# EasyEDA Pro project stm32-motordrive.epro, schematic Schematic3_copy1
Create Date: 2024-04-02; Page Name: P1; Project Name: stm32-motordrive; Schematic Name: Schematic3; Update Date: 2024-04-08; Company: 嘉立创EDA; Page Size: A4; Version: V1.0
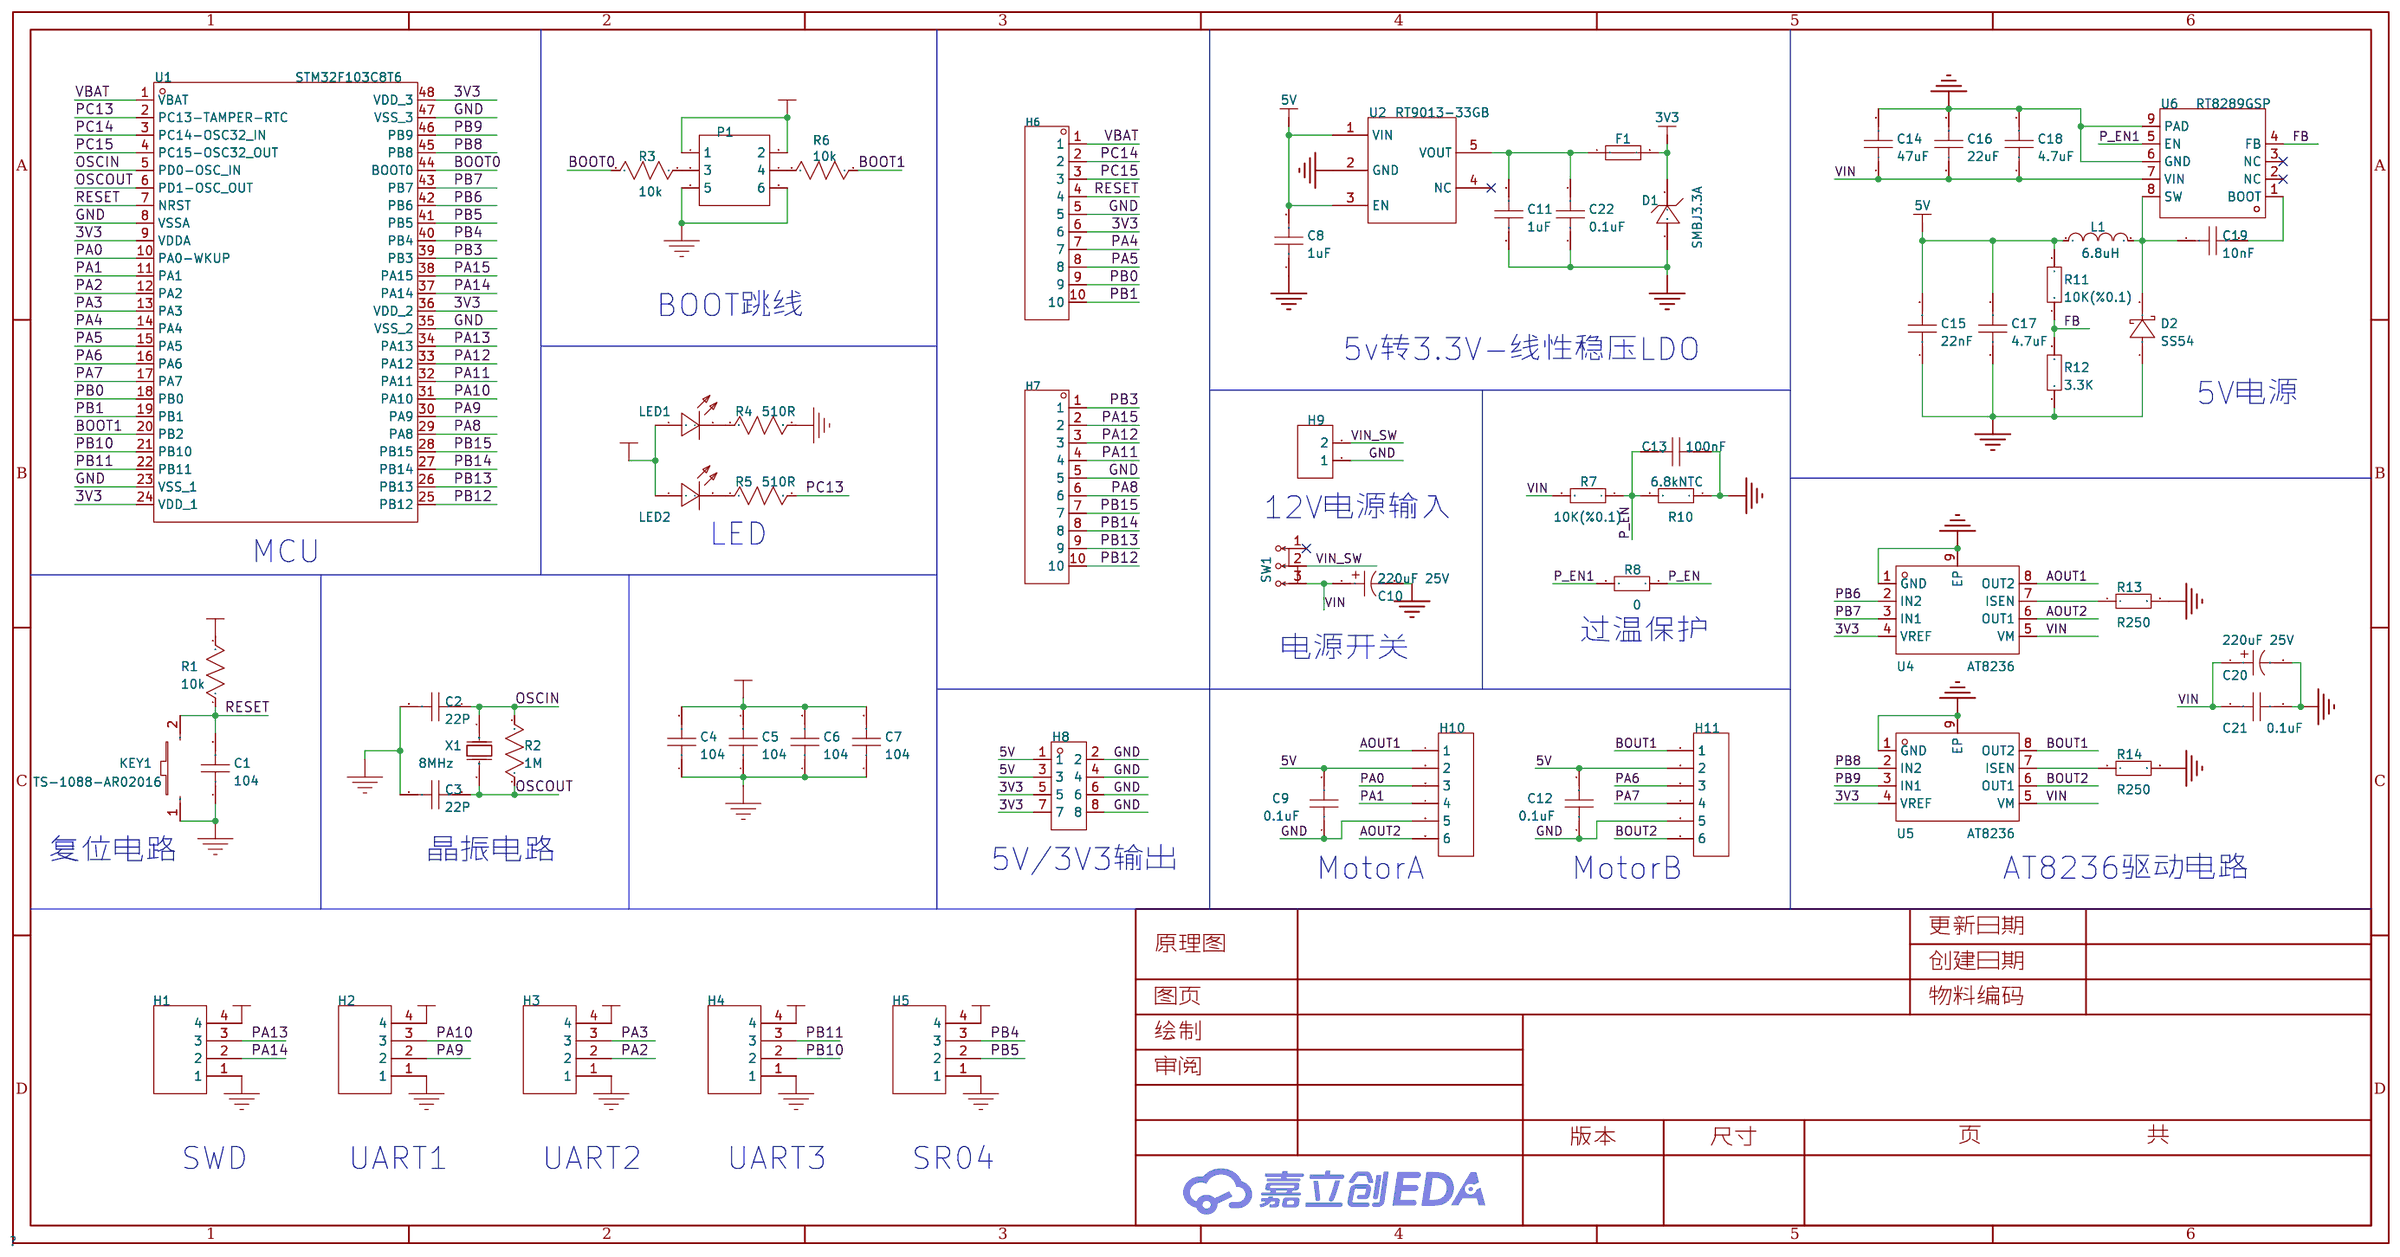
[diagram p1: schematic sheet]

## Parts
C1  104  [C0603]
C2  22P  [C0603]
C3  22P  [C0603]
C4  104  [C0603]
C5  104  [C0603]
C6  104  [C0603]
C7  104  [C0603]
C8  1uF  [C0603]
C9  0.1uF  [C0603]
C10  220uF 25V  [CAP-SMD_BD6.3-L6.6-W6.6-LS7.2-FD]
C11  1uF  [C0603]
C12  0.1uF  [C0603]
C13  100nF  [C0603]
C14  47uF  [C0603]
C15  22nF  [C0603]
C16  22uF  [C0603]
C17  4.7uF  [C0603]
C18  4.7uF  [C0603]
C19  10nF  [C0603]
C20  220uF 25V  [CAP-SMD_BD6.3-L6.6-W6.6-LS7.2-FD]
C21  0.1uF  [C0603]
C22  0.1uF  [C0603]
D1  SMBJ3.3A  [SMB_L4.6-W3.6-LS5.3-RD]
D2  SS54  [SMA_L4.3-W2.6-LS5.0-FD]
F1  BSMD0603-050-6V  [F0603]
H1  PZ254V-11-04P  [HDR-TH_4P-P2.54-V-M]
H2  PZ254V-11-04P  [HDR-TH_4P-P2.54-V-M]
H3  PZ254V-11-04P  [HDR-TH_4P-P2.54-V-M]
H4  PZ254V-11-04P  [HDR-TH_4P-P2.54-V-M]
H5  PZ254V-11-04P  [HDR-TH_4P-P2.54-V-M]
H6  2.54-1*10P针  [HDR-TH_10P-P2.54-V-M-1]
H7  2.54-1*10P针  [HDR-TH_10P-P2.54-V-M-1]
H8  PZ2.54-2*4  [HDR-TH_8P-P2.54-V-M-R2-C4-S2.54]
H9  XY301V-A-5.0-2P  [CONN-TH_XY301V-A-5.0-2P]
H10  -  [XH2.54-LI-6P弯针]
H11  -  [XH2.54-LI-6P弯针]
KEY1  TS-1088-AR02016  [SW-SMD_L3.9-W3.0-P4.45]
L1  6.8uH  [IND-SMD_L7.0-W6.6]
LED1  NCD0805R1  [LED0805-R-RD]
LED2  NCD0805R1  [LED0805-R-RD]
P1  2.54-2*3P针  [HDR-TH_6P-P2.54-V-M-R2-C3-S2.54-1]
R1  10k  [R0603]
R2  1M  [R0603]
R3  10k  [R0603]
R4  510R  [R0603]
R5  510R  [R0603]
R6  10k  [R0603]
R7  10K(%0.1)  [R0603]
R8  0  [R0603]
R10  6.8kNTC  [R0603]
R11  10K(%0.1)  [R0603]
R12  3.3K  [R0603]
R13  R250  [R0603]
R14  R250  [R0603]
SW1  -  [SW-TH_SHOU-HAN_SS12D10G4]
U1  STM32F103C8T6  [LQFP-48_L7.0-W7.0-P0.50-LS9.0-BL]
U2  RT9013-33GB  [SOT-23-5_L3.0-W1.7-P0.95-LS2.8-BL]
U4  AT8236  [ESOP-8_L4.9-W3.9-P1.27-LS6.0-BL-EP]
U5  AT8236  [ESOP-8_L4.9-W3.9-P1.27-LS6.0-BL-EP]
U6  RT8289GSP  [SOIC-8_L5.0-W4.0-P1.27-LS6.0-BL-EP2.0]
X1  8MHz  [CRYSTAL-SMD_L5.0-W3.2]

## Library data of the parts
C1 C4-C7 = 104
C2 C3 = 22P
C8 C9 C11-C19 C21 C22 = CAP_0603: Supplier Footprint: 0603
C10 C20 = RST220UF25V019: 容值:220uF;精度:±20%;额定电压:25V;纹波电流:165mA@120Hz;等效串联电阻:-;; LCSC Part Name: 220uF ±20% 25V; Supplier Part: C4747974; Manufacturer: KNSCHA(科尼盛); Supplier Footprint: SMD,D6.3xL7.7mm; JLCPCB Part Class: Extended Part; Datasheet: https://atta.szlcsc.com/upload/public/pdf/source/20220722/2E7F51AC9BE193B364DA1207D7353D66.pdf; Supplier: LCSC; Tolerance: ±20%; Rated Voltage: 25V; Ripple Current: 165mA@120Hz; φD: 6.3mm; L: 7.7mm; Lifetime @ Temp: 2000hrs@105℃; Operating Temperature: -40℃~+105℃
D1 = SMBJ3.3A_C362089: 反向截止电压(Vrwm):3.3V;最大钳位电压:7.3V;峰值脉冲功率(Ppp)@10/1000us:600W;击穿电压:4.1V;; LCSC Part Name: 单向TVS 3.3V截止 600W峰值脉冲功率; Supplier Part: C362089; Manufacturer: JKSEMI(金开盛); Supplier Footprint: SMB(DO-214AA); JLCPCB Part Class: 扩展库; Datasheet: https://atta.szlcsc.com/upload/public/pdf/source/20200731/C362089_3B984BF84356FE4A5051ADB3F5B1E766.pdf; Supplier: LCSC; Reverse Stand-Off Voltage (Vrwm): 3.3V; Maximum Clamping Voltage: 7.3V; Peak Pulse Power Dissipation (Ppp)@10/1000us: 600W; Breakdown Voltage: 4.1V; Type: TVS
D2 = SS54_C7420369: 二极管配置:独立式;正向压降(Vf):550mV@5.0A;直流反向耐压(Vr):40V;平均整流电流(Io):5A;; LCSC Part Name: 电压:40V 电流:5A; Supplier Part: C7420369; Manufacturer: 宏迦橙; Supplier Footprint: SMA(DO-214AC); JLCPCB Part Class: 扩展库; Datasheet: https://atta.szlcsc.com/upload/public/pdf/source/20230828/254C3882F8647358AD9F60DD73611B5E.pdf; Supplier: LCSC; Diode Configuration: 独立式; Forward Voltage (Vf@If): 550mV@5.0A; Reverse Voltage (Vr): 40V; Average Rectified Current (Io): 5A; Reverse Leakage Current (Ir): 50uA@40V; Peak forward surge current: 120A
F1 = BSMD0603-050-6V: 最大电压:6V;最大电流:40A;保持电流:500mA;跳闸电流:1A;; LCSC Part Name: 6V 500mA 0603自恢复; Supplier Part: C883095; Manufacturer: BHFUSE(佰宏); Supplier Footprint: 0603; JLCPCB Part Class: Extended Part; Datasheet: https://atta.szlcsc.com/upload/public/pdf/source/20230512/E478DE3555A0061DA0124A9F45802B86.pdf; Supplier: LCSC; Operating Voltage (Max): 6V; Current Rating (Max): 40A; Hold Current: 500mA; Trip Current: 1A; Power Dissipation: 500mW; Resistance - Initial (Ri) (Min): 100mΩ; Resistance - Post Trip (R1) (Max): 800mΩ; Maximum Time to Trip: 100ms; Operating Temperature: -40℃~+85℃
H1-H5 = PZ254V-11-04P: 插针结构:1x4P;间距:2.54mm;行距:-;圆针/方针:方针;安装类型:直插;排数:单排;总PIN位数:4P;额定电流:3A;额定电压:250V;配合针长度:6mm;塑高:2.5mm;端接针长度:3mm;触头材质:-;工作温度范围:-40℃~+105℃;颜色:黑色;; LCSC Part Name: 间距:2.54mm 1x4P 直插 方针; Supplier Part: C2691448; Manufacturer: XFCN(兴飞); Supplier Footprint: 插件,P=2.54mm; JLCPCB Part Class: Extended Part; Datasheet: https://atta.szlcsc.com/upload/public/pdf/source/20200309/C492403_F9F19131791D08044AD4F84F8E751A34.pdf; Supplier: LCSC; Pin Structure: 1x4P; Pitch: 2.54mm; Circluar Pins/Square Pins: 方针; Mounting Type: 直插; Number of Rows: 单排; Number of Pins: 4P; Current Rating (Max): 3A; Voltage Rating (Max): 250V; Length of Mating Pin: 6mm; Insulation Height: 2.5mm; Length of End Connection Pin: 3mm; Operating Temperature Range: -40℃~+105℃; Color: 黑色; Origin Footprint 1: 220S-1*4P H=8.5MM Ytype Gold-plated; Origin Footprint 2: DIP-1X4P2.54
H6 H7 = 2.54-1*10P针: 插针结构:1x10P;间距:2.54mm;行距:-;圆针/方针:方针;安装类型:直插;排数:单排;总PIN位数:10P;额定电流:3A;额定电压:-;配合针长度:-;塑高:-;端接针长度:-;触头材质:-;触头镀层:-;工作温度范围:-40℃~+105℃;颜色:黑色;; LCSC Part Name: 间距:2.54mm 1x10P 直插 方针; Supplier Part: C57369; Manufacturer: BOOMELE(博穆精密); Supplier Footprint: 插件,P=2.54mm; JLCPCB Part Class: 扩展库; Datasheet: https://atta.szlcsc.com/upload/public/pdf/source/20151109/1457707572883.pdf; Supplier: LCSC; Pin Structure: 1x10P; Pitch: 2.54mm; Circluar Pins/Square Pins: 方针; Mounting Type: 直插; Number of Rows: 单排; Number of Pins: 10P; Current Rating (Max): 3A; Operating Temperature Range: -40℃~+105℃; Color: 黑色
H8 = PZ2.54-2*4: 插针结构:2x4P;间距:2.54mm;排数:双排;总PIN位数:8P;; Supplier Part: C5156676; Manufacturer: ZHOURI(洲日); Supplier Footprint: 插件,P=2.54mm; JLCPCB Part Class: 扩展库; Datasheet: https://atta.szlcsc.com/upload/public/pdf/source/20220923/0E7A4A94740FFD503E2D73F36F92C1EA.pdf; Supplier: LCSC; Pin Structure: 2x4P; Pitch: 2.54mm; Number of Rows: 双排; Number of Pins: 8P
H9 = XY301V-A-5.0-2P: 结构:1x2P;间距:5mm;颜色:蓝色;安装方式:直插;额定电流:15A;额定电压:300V;排数:1;线规 - AWG:14~22;线规 - 平方毫米:1.5;每排PIN数:2;工作温度范围:-;; LCSC Part Name: 5mm 1x2P 排数:1 每排P数:2 直插; Supplier Part: C557651; Manufacturer: XINLAIYA(新莱亚); Supplier Footprint: 插件,P=5mm; JLCPCB Part Class: Extended Part; Datasheet: https://atta.szlcsc.com/upload/public/pdf/source/20200527/C557652_0563DB88D69D1781C63AEA43A3E9DCA1.pdf; Supplier: LCSC; Structure: 1x2P; Pitch: 5mm; Color: 蓝色; Mounting Style: 直插; Current Rating (Max): 15A; Voltage Rating (Max): 300V; Number of Pins: 2P; Number of Rows: 1; Wire Gauge - AWG: 14~22; Wire Gauge - mm2: 1.5; Number of PINs Per Row: 2
H10 H11 = XH2.54-LI-6P弯针
KEY1 = TS-1088-AR02016: 电路结构:单刀单掷;按钮形状:圆形按钮;作用力:160gf;安装方式:立贴;开关长度:4mm;开关宽度:3mm;开关高度:2mm;带支架:不带;触点电流:50mA;额定电压(DC):12V;绝缘电阻:100MΩ;机械寿命:10万次;; LCSC Part Name: 4*3*2mm 立贴 轻触开关; Supplier Part: C720477; Manufacturer: XUNPU(讯普); Supplier Footprint: SMD; JLCPCB Part Class: Extended Part; Datasheet: https://atta.szlcsc.com/upload/public/pdf/source/20200810/C720475_60D09DD6C54279ADDB2DC25100F1CC11.pdf; Supplier: LCSC; Circuit: 单刀单掷; Actuator Style: 圆形按钮; Operating Force: 160gf; Mounting Style: 立贴; Switch Length: 4mm; Switch Width: 3mm; Switch Height: 2mm; Strike Gundam: 不带; Contact Current: 50mA; Voltage Rating (DC): 12V; Insulation Resistance: 100MΩ; Actuator/Cap Color: 黑色; Pin Style: SMD接片; Mechanical Life: 10万次; Operating Temperature: -30℃~+80℃; Origin Footprint 1: Switch3x4x2; Origin Footprint 2: KEY-3.0*4.0
L1 = FXL0630-6R8-M: 电感值:6.8uH;精度:±20%;额定电流:5A;饱和电流(Isat):6A;类型:一体成型电感;; LCSC Part Name: 6.8uH ±20% 6A; Supplier Part: C167221; Manufacturer: cjiang(长江微电); Supplier Footprint: SMD,6.6x7mm; JLCPCB Part Class: Extended Part; Datasheet: https://atta.szlcsc.com/upload/public/pdf/source/20230516/3A080F5AF8C87BB81C3BA86E5F60E51A.pdf; Supplier: LCSC; Tolerance: ±20%; Rated Current: 5A; Saturation Current (Isat): 6A; DC Resistance (DCR): 48mΩ; Type: 一体成型电感
LED1 LED2 = NCD0805R1: 灯头类型:-;发光颜色:红色;正向电压(VF):1.6V~2.6V;功率:65mW;正向电流:20mA;主波长:615nm~630nm;二极管配置:独立二极管;透镜颜色:无色透明透镜;色温:-;发光强度:67mcd~195mcd;发光角度:130°;载带方式:-;工作温度:-30℃~+85℃;; Supplier Part: C84256; Manufacturer: 国星光电; Supplier Footprint: 0805; JLCPCB Part Class: Basic Part; Datasheet: https://atta.szlcsc.com/upload/public/pdf/source/20200820/C84256_F0A75A43B3EAD75808600A0514C76B99.pdf; Supplier: LCSC; Emitted Color: 红色; Forward Voltage (VF): 1.6V~2.6V; Power Dissipation: 65mW; Forward Current: 20mA; Dominant Wavelength: 615nm~630nm; Diode Configuration: 独立二极管; Lens Color: 无色透明透镜; Luminous Intensity: 67mcd~195mcd; Viewing Angle: 130°; Operating Temperature: -30℃~+85℃; Origin Footprint 1: 204-10SURD/S530-A3; Origin Footprint 2: LED0805-RD
P1 = 2.54-2*3P针: 插针结构:-;间距:2.54mm;行距:-;圆针/方针:-;安装类型:直插;排数:双排;总PIN位数:6P;额定电流:-;额定电压:-;配合针长度:-;塑高:-;触头材质:-;触头镀层:-;颜色:黑色;; LCSC Part Name: 间距:2.54mm 直插; Supplier Part: C65114; Manufacturer: BOOMELE(博穆精密); Supplier Footprint: 插件,P=2.54mm; JLCPCB Part Class: Extended Part; Supplier: LCSC; Pitch: 2.54mm; Mounting Type: 直插; Number of Rows: 双排; Number of Pins: 6P; Color: 黑色; Origin Footprint 1: HDR-IDC-2.54-2X3P; image: //image.lceda.cn/szlcsc/C11214.jpg; Origin Footprint 2: HEADER_PRG_2X3
R1 R3 R6 = 10k
R2 = 1M
R4 R5 = 510R
R7 R8 R10-R14 = Res_0603: Supplier Footprint: 0603
SW1 = 3脚两档开关(SS12D10G4型号）
U1 = STM32F103C8T6: CPU内核:CM3;程序存储容量:64KB;RAM总容量:20KB;GPIO端口数量:37;工作电压范围:2V~3.6V;CPU最大主频:72MHz;程序存储器类型:FLASH;; LCSC Part Name: STM32F103C8T6 MSL=3; Supplier Part: C8734; Manufacturer: ST(意法半导体); Supplier Footprint: LQFP-48(7x7); JLCPCB Part Class: Extended Part; Datasheet: https://atta.szlcsc.com/upload/public/pdf/source/20220812/8363ACEC51AD55ECEB84799464F7CB85.pdf; Supplier: LCSC; CPU Core: CM3; Program Storage Size: 64KB; RAM Size: 20KB; GPIO Ports Number: 37; Operating Voltage Range: 2V~3.6V; CPU Maximum Speed: 72MHz; Program Memory Type: FLASH; Operating Temperature Range: -40℃~+85℃; ADC (Bit): 12bit; Universal Serial Bus: 有; Peripheral/Function: 看门狗；DMA；看门狗；片载温度传感器; Watchdog: 有; Infrared Data Association: 有; Low-Voltage Detect: 有; Direct Memory Access: 有; Internal Oscillator: 有; image: //image.lceda.cn/szlcsc/C8734.jpg
U2 = RT9013-33GB: 输出类型:固定;最大输入电压:5.5V;输出电压:3.3V;最大输出电流:500mA;电源纹波抑制比(PSRR):50dB@(10kHz);输出极性:正极;; LCSC Part Name: 输入5.5V 输出3.3V 500mA; Supplier Part: C47773; Manufacturer: RICHTEK(立锜); Supplier Footprint: SOT-23-5; JLCPCB Part Class: 扩展库; Datasheet: https://atta.szlcsc.com/upload/public/pdf/source/20150504/1457707282459.pdf; Supplier: LCSC; Output Type: 固定; Maximum Input Voltage: 5.5V; Output Voltage: 3.3V; MAX Output Current: 500mA; Power Supply Rejection Ratio (PSRR): 50dB@(10kHz); Dropout Voltage: 400mV@(500mA); standby current: 50uA; Operating Temperature: -40℃~+85℃; Output Polarity: 正极; Number of Outputs: 1
U4 U5 = AT8236: Supplier Part: C2827823; Manufacturer: 杭州中科微; Supplier Footprint: ESOP-8; JLCPCB Part Class: 扩展库; Datasheet: https://atta.szlcsc.com/upload/public/pdf/source/20210923/1552D95CBAF8BE780D06AE79E7783380.pdf; Supplier: LCSC
U6 = RT8289GSP: 功能类型:降压型;输出类型:可调;输入电压:5.5V~32V;输出电压:1.222V~26V;输出电流(最大值):5A;; Supplier Part: C39202; Manufacturer: RICHTEK(立锜); Supplier Footprint: SOIC-8-EP; JLCPCB Part Class: 扩展库; Datasheet: https://atta.szlcsc.com/upload/public/pdf/source/20141219/1457707253176.pdf; Supplier: LCSC; Function: 降压型; Output Type: 可调; Input Voltage: 5.5V~32V; Output Voltage: 1.222V~26V; Output Current (Max): 5A; Switching Frequency: 500kHz; Operating Temperature: -40℃~+85℃@(TA); Synchronous Rectification: 否; Number of Outputs: 1; Topology: 降压式; Switch tube (built-in/external): 内置
X1 = X50328MSB2GI: 晶振类型:贴片晶振;频率:8MHz;常温频差:±10ppm;外接负载电容:20pF;频率稳定度(全温):±20ppm;; LCSC Part Name: 8MHz ±10ppm 20pF YSX530GA; Supplier Part: C115962; Manufacturer: YXC(扬兴晶振); Supplier Footprint: SMD5032; JLCPCB Part Class: Basic Part; Datasheet: https://atta.szlcsc.com/upload/public/pdf/source/20240329/44922B0AF7B60E58E9B66993B6077277.pdf; Supplier: LCSC; Crystal Type: 贴片晶振; Normal temperature Frequency Tolerance: ±10ppm; External load capacitor: 20pF; Frequency Stability(Full temperature range): ±20ppm; Operating Temperature: -40℃~+85℃; Origin Footprint 2: HC-49-SMD_L7.0-W3.0

## Nets
3V3: C4.2 C5.2 C6.2 C7.2 D1.1 F1.2 H1.4 H6.6 H8.5 H8.7 LED1.1(A) LED2.1(A) P1.1 P1.2 R1.2 U1.9(VDDA) U1.24(VDD_1) U1.36(VDD_2) U1.48(VDD_3) U4.4(VREF) U5.4(VREF)
5V: C8.2 C9.2 C12.2 C15.2 C17.2 H2.4 H3.4 H4.4 H5.4 H8.1 H8.3 H10.2 H11.2 L1.1 R11.2 U2.1(VIN) U2.3(EN)
GND: C1.1 C2.2 C3.2 C4.1 C5.1 C6.1 C7.1 C8.1 C9.1 C10.2 C11.1 C12.1 C13.1 C14.2 C15.1 C16.2 C17.1 C18.2 C20.2 C21.1 C22.1 D1.2 D2.1(A) H1.1 H2.1 H3.1 H4.1 H5.1 H6.5 H7.5 H8.2 H8.4 H8.6 H8.8 H9.1 H10.5 H11.5 KEY1.1 P1.5 P1.6 R4.2 R10.1 R12.1 R13.2 R14.2 U1.8(VSSA) U1.23(VSS_1) U1.35(VSS_2) U1.47(VSS_3) U2.2(GND) U4.1(GND) U4.9(EP) U5.1(GND) U5.9(EP) U6.6(GND) U6.9(PAD)
VBAT: H6.1 U1.1(VBAT)
VIN: C10.1 C14.1 C16.1 C18.1 C20.1 C21.2 R7.2 SW1.3 U4.5(VM) U5.5(VM) U6.7(VIN)
VIN_SW: H9.2 SW1.2
AOUT1: H10.1 U4.8(OUT2)
AOUT2: H10.6 U4.6(OUT1)
BOOT0: R3.2 U1.44(BOOT0)
BOOT1: R6.1 U1.20(PB2)
BOUT1: H11.1 U5.8(OUT2)
BOUT2: H11.6 U5.6(OUT1)
FB: R11.1 R12.2 U6.4(FB)
OSCIN: C2.1 R2.2 U1.5(PD0-OSC_IN) X1.1(OSC1)
OSCOUT: C3.1 R2.1 U1.6(PD1-OSC_OUT) X1.2(OSC2)
P_EN: C13.2 R7.1 R8.1 R10.2
P_EN1: R8.2 U6.5(EN)
PA0: H10.3 U1.10(PA0-WKUP)
PA1: H10.4 U1.11(PA1)
PA2: H3.2 U1.12(PA2)
PA3: H3.3 U1.13(PA3)
PA4: H6.7 U1.14(PA4)
PA5: H6.8 U1.15(PA5)
PA6: H11.3 U1.16(PA6)
PA7: H11.4 U1.17(PA7)
PA8: H7.6 U1.29(PA8)
PA9: H2.2 U1.30(PA9)
PA10: H2.3 U1.31(PA10)
PA11: H7.4 U1.32(PA11)
PA12: H7.3 U1.33(PA12)
PA13: H1.3 U1.34(PA13)
PA14: H1.2 U1.37(PA14)
PA15: H7.2 U1.38(PA15)
PB0: H6.9 U1.18(PB0)
PB1: H6.10 U1.19(PB1)
PB3: H7.1 U1.39(PB3)
PB4: H5.3 U1.40(PB4)
PB5: H5.2 U1.41(PB5)
PB6: U1.42(PB6) U4.2(IN2)
PB7: U1.43(PB7) U4.3(IN1)
PB8: U1.45(PB8) U5.2(IN2)
PB9: U1.46(PB9) U5.3(IN1)
PB10: H4.2 U1.21(PB10)
PB11: H4.3 U1.22(PB11)
PB12: H7.10 U1.25(PB12)
PB13: H7.9 U1.26(PB13)
PB14: H7.8 U1.27(PB14)
PB15: H7.7 U1.28(PB15)
PC13: R5.2 U1.2(PC13-TAMPER-RTC)
PC14: H6.2 U1.3(PC14-OSC32_IN)
PC15: H6.3 U1.4(PC15-OSC32_OUT)
RESET: C1.2 H6.4 KEY1.2 R1.1 U1.7(NRST)
$1N1502: P1.3 R3.1
$1N1510: P1.4 R6.2
$1N1523: LED1.2(K) R4.1
$1N1525: LED2.2(K) R5.1
$1N6534: C19.2 U6.1(BOOT)
$1N6587: C19.1 D2.2(K) L1.2 U6.8(SW)
$1N6590: R13.1 U4.7(ISEN)
$1N26418: R14.1 U5.7(ISEN)
$1N71314: C11.2 C22.2 F1.1 U2.5(VOUT)

Not connected (* = marked no-connect by the designer): SW1 1*; U2 4(NC)*; U6 2(NC)* 3(NC)*

## Notes on the sheet
- BOOT跳线
- 5v转3.3V-线性稳压LDO
- 5V电源
- 12V电源输入
- LED
- MCU
- 过温保护
- 电源开关
- 复位电路
- 晶振电路
- 5V/3V3输出
- MotorA
- MotorB
- AT8236驱动电路
- SWD
- UART1
- UART2
- UART3
- SR04
